# Altium schematic sheet [02] - BLOCK DIAGRAM.SchDoc
size Letter; Author: Daniel E. Mundo; DocumentNumber: 2; Revision: 1.0; SheetNumber: 2; SheetTotal: 5
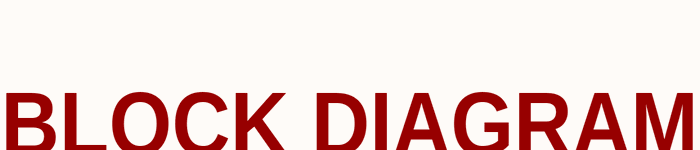
[diagram p0: [02] - BLOCK DIAGRAM.SchDoc]

## Notes on the sheet
- BLOCK DIAGRAM
- Project:
- Page content:
- Revision:
- Size:
- Letter
- Design:
- Document Number:
- Date:
- Sheet:
- of